# Altium schematic sheet glcd_128_64.SchDoc
size A4; Engineer: Amir Hossein Jobeiri; Organization: Simaran; SheetNumber: 7; SheetTotal: 23
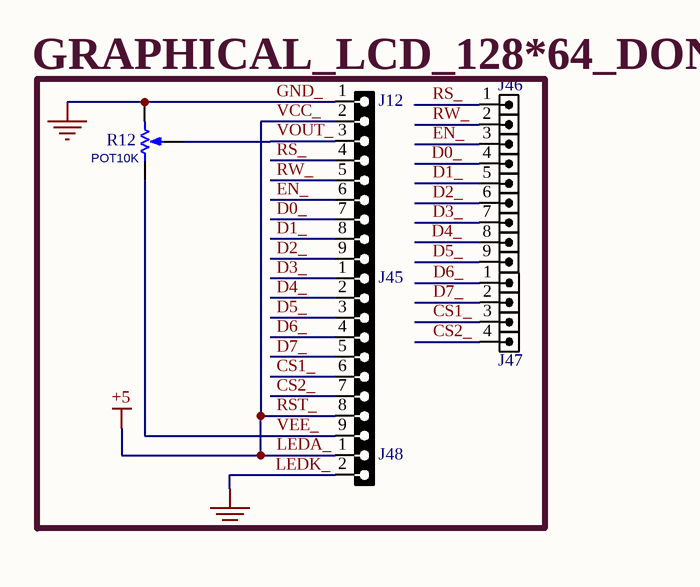
[diagram p0: glcd_128_64.SchDoc]

## Parts
J12  HDRF9  [HDR_F_1X9]  (value not drawn)
J45  HDRF9  [HDR_F_1X9]  (value not drawn)
J46  HDR1X9  [HDR_M_1X9]  (value not drawn)
J47  HDR1X4  [HDR_M_1X4]  (value not drawn)
J48  HDRF2  [HDR_F_1X2]  (value not drawn)
R12  POT10K  [POT_7X5]

## Nets
GND_: J12.1 J48.2 R12.3(BOT)  [also labelled GND, LEDK_]
LEDA_: J12.2 J45.8 J48.1  [also labelled +5, RST_, VCC_]
CS1_: J45.6 J47.3
CS2_: J45.7 J47.4
D0_: J12.7 J46.4
D1_: J12.8 J46.5
D2_: J12.9 J46.6
D3_: J45.1 J46.7
D4_: J45.2 J46.8
D5_: J45.3 J46.9
D6_: J45.4 J47.1
D7_: J45.5 J47.2
EN_: J12.6 J46.3
RS_: J12.4 J46.1
RW_: J12.5 J46.2
VEE_: J45.9 R12.1(TOP)
VOUT_: J12.3 R12.2(TAP)

## Notes on the sheet
- GRAPHICAL_LCD_128*64_DONE

## Library data of the parts
J12 J45 = HDR_F_1X9: CONN, HEADER, Female, pitch: 2.54mm, 9POS; VALUE: HDRF9
J46 = HDR_M_1X9: CONN, HEADER, Male, pitch: 2.54mm, 9POS; VALUE: HDRM9
J47 = HDR_M_1X4: CONN, HEADER, Male, pitch: 2.54mm, 4POS; VALUE: HDRM4
J48 = HDR_F_1X2: CONN, HEADER, Female, pitch: 2.54mm, 2POS; VALUE: HDRF2
R12 = RES_THD_POT_7X5: RESISTOR, THD, Potentiometer; VALUE: POT10K